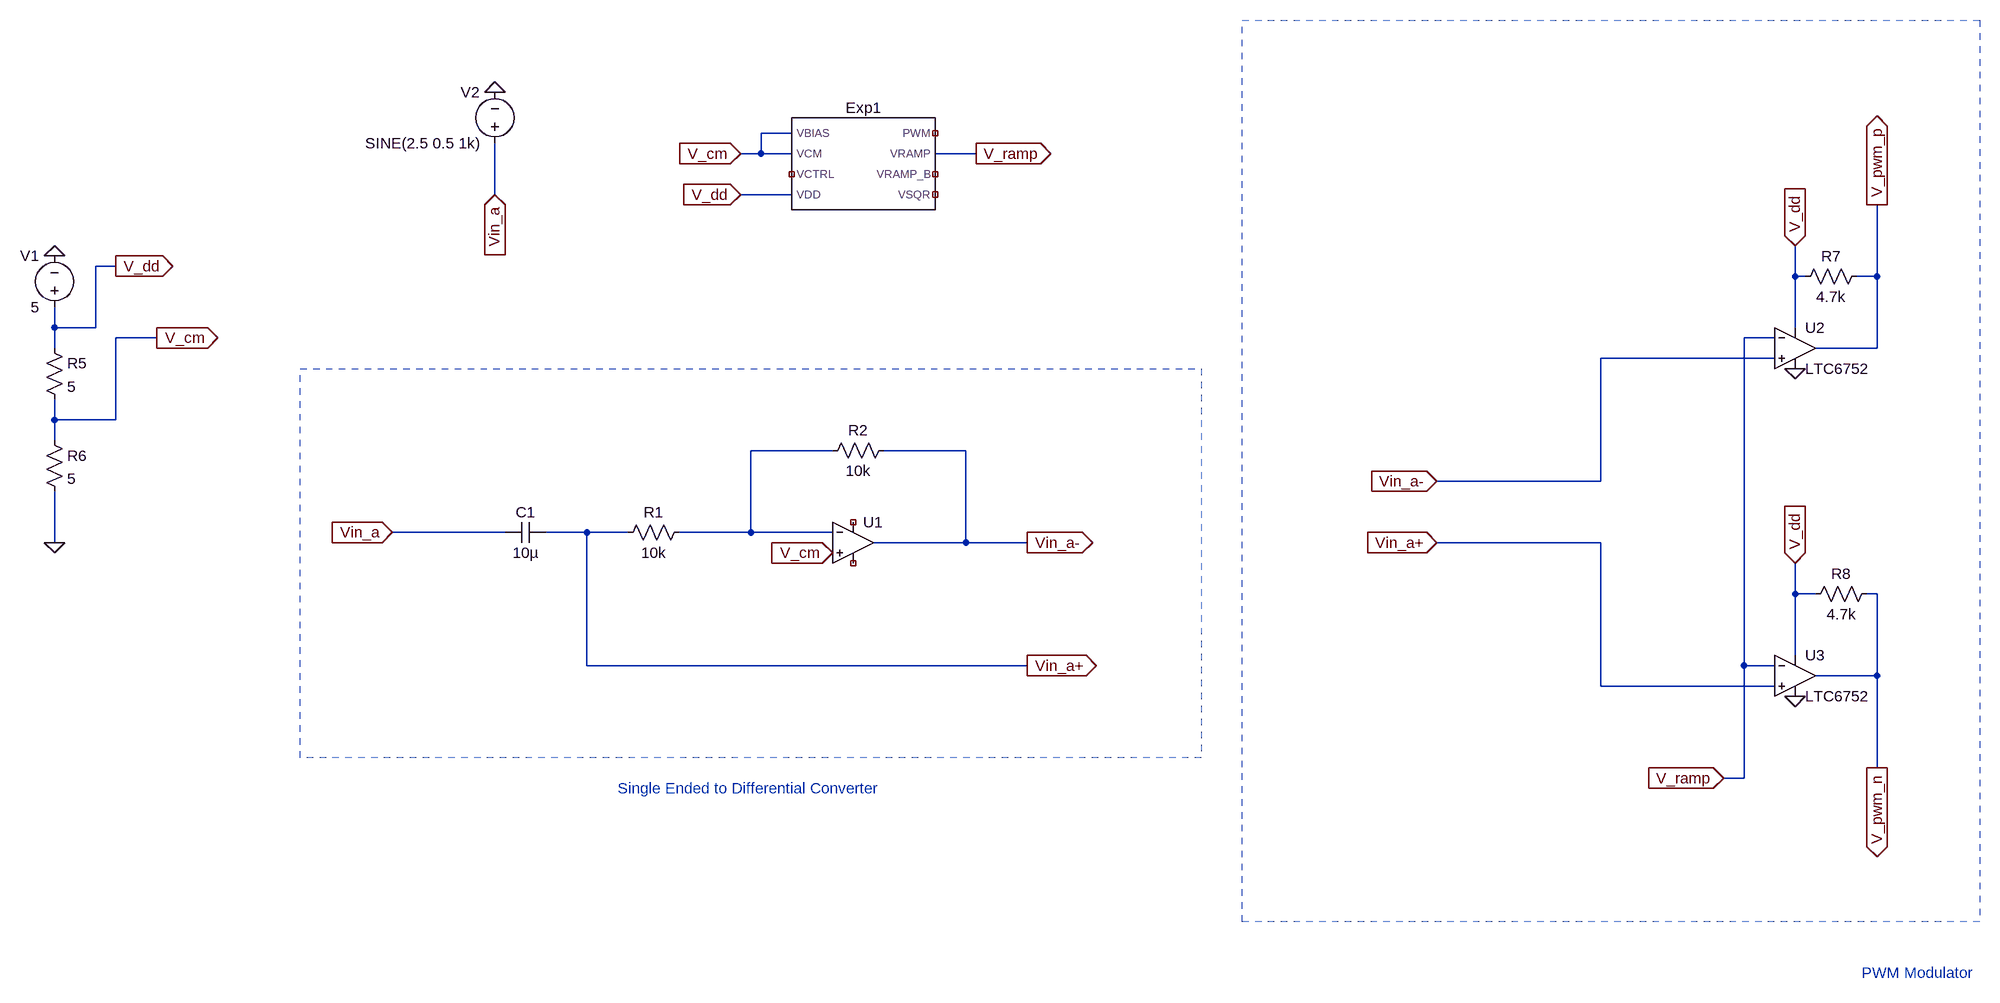
[diagram p0: schematic Draft1.asc]
Draft1.asc, the LTspice schematic file:
Version 4
SHEET 1 4692 1492
WIRE 2080 -96 2032 -96
WIRE 2032 -64 2032 -96
WIRE 2032 -64 2000 -64
WIRE 2080 -64 2032 -64
WIRE 2368 -64 2304 -64
WIRE 1616 0 1616 -80
WIRE 2080 0 2000 0
WIRE 1024 112 992 112
WIRE 3648 128 3648 80
WIRE 3664 128 3648 128
WIRE 3776 128 3776 16
WIRE 3776 128 3744 128
WIRE 928 208 928 176
WIRE 992 208 992 112
WIRE 992 208 928 208
WIRE 3648 208 3648 128
WIRE 1088 224 1024 224
WIRE 3616 224 3568 224
WIRE 928 240 928 208
WIRE 3776 240 3776 128
WIRE 3776 240 3680 240
WIRE 3616 256 3344 256
WIRE 928 352 928 320
WIRE 1024 352 1024 224
WIRE 1024 352 928 352
WIRE 928 384 928 352
WIRE 2144 400 2016 400
WIRE 2352 400 2224 400
WIRE 3344 448 3344 256
WIRE 3344 448 3088 448
WIRE 1632 528 1456 528
WIRE 1760 528 1696 528
WIRE 1824 528 1760 528
WIRE 2016 528 2016 400
WIRE 2016 528 1904 528
WIRE 2144 528 2016 528
WIRE 928 544 928 464
WIRE 2352 544 2352 400
WIRE 2352 544 2208 544
WIRE 2448 544 2352 544
WIRE 3344 544 3088 544
WIRE 3648 624 3648 576
WIRE 3680 624 3648 624
WIRE 3776 624 3760 624
WIRE 3648 720 3648 624
WIRE 1760 736 1760 528
WIRE 2448 736 1760 736
WIRE 3568 736 3568 224
WIRE 3616 736 3568 736
WIRE 3776 752 3776 624
WIRE 3776 752 3680 752
WIRE 3344 768 3344 544
WIRE 3616 768 3344 768
WIRE 3776 896 3776 752
WIRE 3568 912 3568 736
WIRE 3568 912 3536 912
FLAG 1456 528 Vin_a
IOPIN 1456 528 In
FLAG 2448 544 Vin_a-
IOPIN 2448 544 Out
FLAG 2448 736 Vin_a+
IOPIN 2448 736 Out
FLAG 3536 912 V_ramp
IOPIN 3536 912 In
FLAG 3088 448 Vin_a-
IOPIN 3088 448 In
FLAG 3088 544 Vin_a+
IOPIN 3088 544 In
FLAG 3776 16 V_pwm_p
IOPIN 3776 16 Out
FLAG 3776 896 V_pwm_n
IOPIN 3776 896 Out
FLAG 928 96 0
FLAG 928 544 0
FLAG 1088 224 V_cm
IOPIN 1088 224 Out
FLAG 2000 -64 V_cm
IOPIN 2000 -64 In
FLAG 1024 112 V_dd
IOPIN 1024 112 Out
FLAG 2000 0 V_dd
IOPIN 2000 0 In
FLAG 3648 80 V_dd
IOPIN 3648 80 In
FLAG 3648 576 V_dd
IOPIN 3648 576 In
FLAG 3648 272 0
FLAG 3648 784 0
FLAG 2368 -64 V_ramp
IOPIN 2368 -64 Out
FLAG 1616 -160 0
FLAG 1616 0 Vin_a
IOPIN 1616 0 In
FLAG 2144 560 V_cm
IOPIN 2144 560 In
SYMBOL cap 1696 512 R90
WINDOW 0 0 32 VBottom 2
WINDOW 3 32 32 VTop 2
SYMATTR InstName C1
SYMATTR Value 10µ
SYMBOL res 1920 512 R90
WINDOW 0 0 56 VBottom 2
WINDOW 3 32 56 VTop 2
SYMATTR InstName R1
SYMATTR Value 10k
SYMBOL res 2240 384 R90
WINDOW 0 0 56 VBottom 2
WINDOW 3 32 56 VTop 2
SYMATTR InstName R2
SYMATTR Value 10k
SYMBOL OpAmps\\UniversalOpAmp 2176 544 R0
SYMATTR InstName U1
SYMBOL Comparators\\LTC6752 3648 176 R0
SYMATTR InstName U2
SYMBOL Comparators\\LTC6752 3648 688 R0
SYMATTR InstName U3
SYMBOL Exp_1_block 2192 -48 R0
SYMATTR InstName Exp1
SYMBOL voltage 928 192 R180
WINDOW 0 24 96 Left 2
WINDOW 3 24 16 Left 2
WINDOW 123 0 0 Left 0
WINDOW 39 0 0 Left 0
SYMATTR InstName V1
SYMATTR Value 5
SYMBOL res 912 224 R0
SYMATTR InstName R5
SYMATTR Value 5
SYMBOL res 912 368 R0
SYMATTR InstName R6
SYMATTR Value 5
SYMBOL res 3760 112 R90
WINDOW 0 0 56 VBottom 2
WINDOW 3 32 56 VTop 2
SYMATTR InstName R7
SYMATTR Value 4.7k
SYMBOL res 3776 608 R90
WINDOW 0 0 56 VBottom 2
WINDOW 3 32 56 VTop 2
SYMATTR InstName R8
SYMATTR Value 4.7k
SYMBOL voltage 1616 -64 R180
WINDOW 0 24 96 Left 2
WINDOW 3 24 16 Left 2
WINDOW 123 0 0 Left 0
WINDOW 39 0 0 Left 0
SYMATTR InstName V2
SYMATTR Value SINE(2.5 0.5 1k)
TEXT 1808 928 Left 2 ;Single Ended to Differential Converter
TEXT 3752 1216 Left 2 ;PWM Modulator
RECTANGLE Normal 2720 880 1312 272 2
RECTANGLE Normal 3936 1136 2784 -272 2

The netlist it stands for:
* Draft1.asc
C1 Vin_a+ Vin_a 10µ
R1 N001 Vin_a+ 10k
R2 Vin_a- N001 10k
XU1 V_cm N001 NC_01 NC_02 Vin_a- level1 Avol=1Meg GBW=10Meg Vos=0 En=0 Enk=0 In=0 Ink=0 Rin=500Meg  ; pins In+ In- V+ V- OUT
XU2 Vin_a- V_ramp V_dd 0 V_pwm_p LTC6752  ; pins In+ In- V+ V- OUT
XU3 Vin_a+ V_ramp V_dd 0 V_pwm_n LTC6752  ; pins In+ In- V+ V- OUT
XExp1 V_cm V_cm NC_03 V_dd NC_04 V_ramp NC_05 NC_06 Exp_1_block  ; pins VBIAS VCM VCTRL VDD PWM VRAMP VRAMP_B VSQR
V1 V_dd 0 5
R5 V_dd V_cm 5
R6 V_cm 0 5
R7 V_pwm_p V_dd 4.7k
R8 V_pwm_n V_dd 4.7k
V2 Vin_a 0 SINE(2.5 0.5 1k)
* Single Ended to Differential Converter
* PWM Modulator
.lib UniversalOpAmp1.lib
.lib LTC7.lib
.backanno
.end